# EAGLE schematic generator 36KHz (EAGLE 8.3.2)
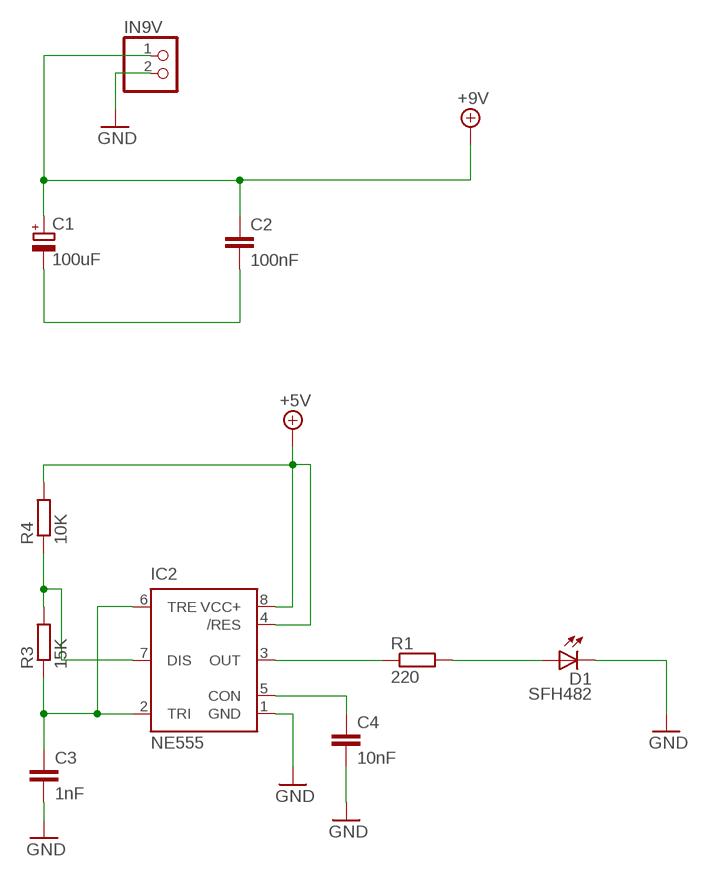
[diagram p0: schematic, sheet 1]

## Parts
C1  100uF  CPOL-EUE10-22.5  [EB22,5D]
C2  100nF  C2,5-3  [C2.5-3]
C3  1nF  C2,5-3  [C2.5-3]
C4  10nF  C2,5-3  [C2.5-3]
D1  SFH482  [SFH482]
IC2  NE555  [DIL-08]
IN9V  PINHD-1X2  [1X02]
R1  220  R-EU_0207/5V  [0207/5V]
R3  15K  R-EU_0207/5V  [0207/5V]
R4  10K  R-EU_0207/5V  [0207/5V]

## Nets
+5V: IC2.4(/RES) IC2.8(VCC+) R4.2
+9V: C1.+ C2.1 IN9V.1
GND: C3.2 C4.2 D1.K(C) IC2.1(GND) IN9V.2
N$1: IC2.3(OUT) R1.1
N$2: D1.A R1.2
N$5: C3.1 IC2.2(TRI) IC2.6(TRE) R3.1
N$6: IC2.7(DIS) R3.2 R4.1
N$10: C1.- C2.2
N$12: C4.1 IC2.5(CON)

## Library data of the parts
C1 = rcl:CPOL-EU: POLARIZED CAPACITOR, European symbol
C2-C4 = capacitor-wima:C: CAPACITOR naming: grid - package width
D1 = led:SFH482: IR LED infrared emitting diode, Infineon
IC2 = st-microelectronics:NE555: General purpose bipolar Timer; MF: Arrow Electronics; MPN: NE555N; OC_FARNELL: 1467742; OC_NEWARK: 89K1486
IN9V = pinhead:PINHD-1X2: PIN HEADER
R1 R3 R4 = rcl:R-EU_: RESISTOR, European symbol